# Altium schematic sheet VNH5019A-E_DC_MotorDriver.SchDoc
size Letter
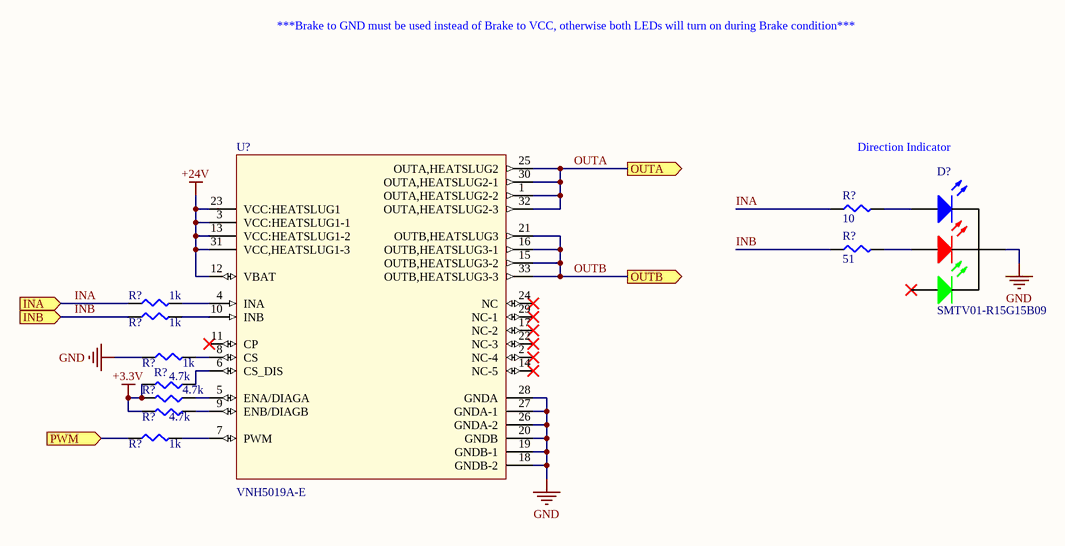
[diagram p0: VNH5019A-E_DC_MotorDriver.SchDoc]

## Parts
(Parts that share a designator on the sheet are numbered #1, #2 ... from top to bottom, then left to right.)
D?  SMTV01-R15G15B09  [SMTV01-R15G15B09]
R?#1  10  [SMD-0603-RES]
R?#2  51  [SMD-0603-RES]
R?#3  1k  [SMD-0603-RES]
R?#4  1k  [SMD-0603-RES]
R?#5  1k  [SMD-0603-RES]
R?#6  4.7k  [SMD-0603-RES]
R?#7  4.7k  [SMD-0603-RES]
R?#8  4.7k  [SMD-0603-RES]
R?#9  1k  [SMD-0603-RES]
U?  VNH5019A-E  [IC_VNH5019ATR-E]

## Ports
INA (in), INB (in), OUTA (out), OUTB (out), PWM (in)

## Nets
+3.3V: R?#6.2 R?#7.2 R?#8.2
+24V: U?.3(VCC:HEATSLUG1-1) U?.12(VBAT) U?.13(VCC:HEATSLUG1-2) U?.23(VCC:HEATSLUG1) U?.31(VCC,HEATSLUG1-3)
GND: D?.1(Cathode) R?#5.1 U?.18(GNDB-2) U?.19(GNDB-1) U?.20(GNDB) U?.26(GNDA-2) U?.27(GNDA-1) U?.28(GNDA)
INA: R?#1.1 R?#3.1 ; port INA
INB: R?#2.1 R?#4.1 ; port INB
OUTA: U?.1(OUTA,HEATSLUG2-2) U?.25(OUTA,HEATSLUG2) U?.30(OUTA,HEATSLUG2-1) U?.32(OUTA,HEATSLUG2-3) ; port OUTA
OUTB: U?.15(OUTB,HEATSLUG3-2) U?.16(OUTB,HEATSLUG3-1) U?.21(OUTB,HEATSLUG3) U?.33(OUTB,HEATSLUG3-3) ; port OUTB
PWM: R?#9.1 ; port PWM
NetD?_2: D?.2(B_A) R?#1.2
NetD?_3: D?.3(R_A) R?#2.2
NetR?#3_2: R?#3.2 U?.4(INA)
NetR?#4_2: R?#4.2 U?.10(INB)
NetR?#5_2: R?#5.2 U?.8(CS)
NetR?#6_1: R?#6.1 U?.6(CS_DIS)
NetR?#7_1: R?#7.1 U?.5(ENA/DIAGA)
NetR?#8_1: R?#8.1 U?.9(ENB/DIAGB)
NetR?#9_2: R?#9.2 U?.7(PWM)

Not connected (* = marked no-connect by the designer): D? 4(G_A)*; U? 2(NC-4)* 11(CP)* 14(NC-5)* 17(NC-2)* 22(NC-3)* 24(NC)* 29(NC-1)*

## Notes on the sheet
- ***Brake to GND must be used instead of Brake to VCC, otherwise both LEDs will turn on during Brake condition***
- Direction Indicator

## Library data of the parts
D? = SMTV01-R15G15B09: LIGHT PIPE ADAPTER RED/GRN/BLU / Manufacturer PN: SMTV01-R15G15B09
R?#1 = ERJ-3EKF10R0V: RES SMD 10 OHM 1% 1/10W 0603; Manufacturer: Panasonic Electronic Components; Factory Stock: 0; Unit Price (USD): 0.00379; @ qty: 1500; Minimum Quantity: 1; Power (Watts): 0.1W, 1/10W; Temperature Coefficient: ±100ppm/°C; Part Number: ERJ-3EKF10R0V; Datasheets: http://industrial.panasonic.com/www-cgi/jvcr13pz.cgi?E+PZ+3+AOA0002+ERJ3EKF10R0V+7+WW; Image: //media.digikey.com/Photos/Panasonic%20Photos/MFG_ERJ-P6W%20Series.jpg; Digi-Key Part Number: P10.0HCT-ND; Quantity Available: 676435; Packaging: Cut Tape (CT); Series: ERJ; Part Status: Active; Value: 10; Tolerance: ±1%; Composition: Thick Film; Features: Automotive AEC-Q200; Operating Temperature: -55°C ~ 155°C; Package / Case: 0603 (1608 Metric); Supplier Device Package: 0603; Size / Dimension: 0.063" L x 0.031" W (1.60mm x 0.80mm); Height - Seated (Max): 0.022" (0.55mm); Number of Terminations: 2; Failure Rate: -
R?#2 = ERJ-3EKF51R0V: RES SMD 51 OHM 1% 1/10W 0603; Manufacturer: Panasonic Electronic Components; Factory Stock: 0; Unit Price (USD): 0.00379; @ qty: 1500; Minimum Quantity: 1; Power (Watts): 0.1W, 1/10W; Temperature Coefficient: ±100ppm/°C; Part Number: ERJ-3EKF51R0V; Datasheets: http://industrial.panasonic.com/www-cgi/jvcr13pz.cgi?E+PZ+3+AOA0002+ERJ3EKF51R0V+7+WW; Image: //media.digikey.com/Photos/Panasonic%20Photos/MFG_ERJ-P6W%20Series.jpg; Digi-Key Part Number: P51.0HCT-ND; Quantity Available: 129747; Packaging: Cut Tape (CT); Series: ERJ; Part Status: Active; Value: 51; Tolerance: ±1%; Composition: Thick Film; Features: Automotive AEC-Q200; Operating Temperature: -55°C ~ 155°C; Package / Case: 0603 (1608 Metric); Supplier Device Package: 0603; Size / Dimension: 0.063" L x 0.031" W (1.60mm x 0.80mm); Height - Seated (Max): 0.022" (0.55mm); Number of Terminations: 2; Failure Rate: -
R?#3-R?#5 R?#9 = ERJ-3EKF1001V: RES SMD 1K OHM 1% 1/10W 0603; Manufacturer: Panasonic Electronic Components; Factory Stock: 0; Unit Price (USD): 0.00379; @ qty: 1500; Minimum Quantity: 1; Power (Watts): 0.1W, 1/10W; Temperature Coefficient: ±100ppm/°C; Part Number: ERJ-3EKF1001V; Datasheets: http://industrial.panasonic.com/www-cgi/jvcr13pz.cgi?E+PZ+3+AOA0002+ERJ3EKF1001V+7+WW; Image: //media.digikey.com/Photos/Panasonic%20Photos/MFG_ERJ-P6W%20Series.jpg; Digi-Key Part Number: P1.00KHCT-ND; Quantity Available: 5218845; Packaging: Cut Tape (CT); Series: ERJ; Part Status: Active; Value: 1k; Tolerance: ±1%; Composition: Thick Film; Features: Automotive AEC-Q200; Operating Temperature: -55°C ~ 155°C; Package / Case: 0603 (1608 Metric); Supplier Device Package: 0603; Size / Dimension: 0.063" L x 0.031" W (1.60mm x 0.80mm); Height - Seated (Max): 0.022" (0.55mm); Number of Terminations: 2; Failure Rate: -
R?#6-R?#8 = ERJ-3EKF4701V: RES SMD 4.7K OHM 1% 1/10W 0603; Manufacturer: Panasonic Electronic Components; Factory Stock: 0; Unit Price (USD): 0.00379; @ qty: 1500; Minimum Quantity: 1; Power (Watts): 0.1W, 1/10W; Temperature Coefficient: ±100ppm/°C; Part Number: ERJ-3EKF4701V; Datasheets: http://industrial.panasonic.com/www-cgi/jvcr13pz.cgi?E+PZ+3+AOA0002+ERJ3EKF4701V+7+WW; Image: //media.digikey.com/Photos/Panasonic%20Photos/MFG_ERJ-P6W%20Series.jpg; Digi-Key Part Number: P4.70KHCT-ND; Quantity Available: 999380; Packaging: Cut Tape (CT); Series: ERJ; Part Status: Active; Value: 4.7k; Tolerance: ±1%; Composition: Thick Film; Features: Automotive AEC-Q200; Operating Temperature: -55°C ~ 155°C; Package / Case: 0603 (1608 Metric); Supplier Device Package: 0603; Size / Dimension: 0.063" L x 0.031" W (1.60mm x 0.80mm); Height - Seated (Max): 0.022" (0.55mm); Number of Terminations: 2; Failure Rate: -
U? = VNH5019A-E: VNH5019A Series 24 V 30 A Fully Integrated H-Bridge Motor Driver-MultiPowerSO-30; MF: STMicroelectronics; Package: SOP-30 STMicroelectronics; Price: None; Availability: Unavailable; MP: VNH5019A-E; SnapEDA_Link: https://www.snapeda.com/parts/VNH5019A-E/STMicroelectronics/view-part/?ref=snap; Value: *